# Altium schematic sheet FMC_Carrier_channel.SchDoc
size A3
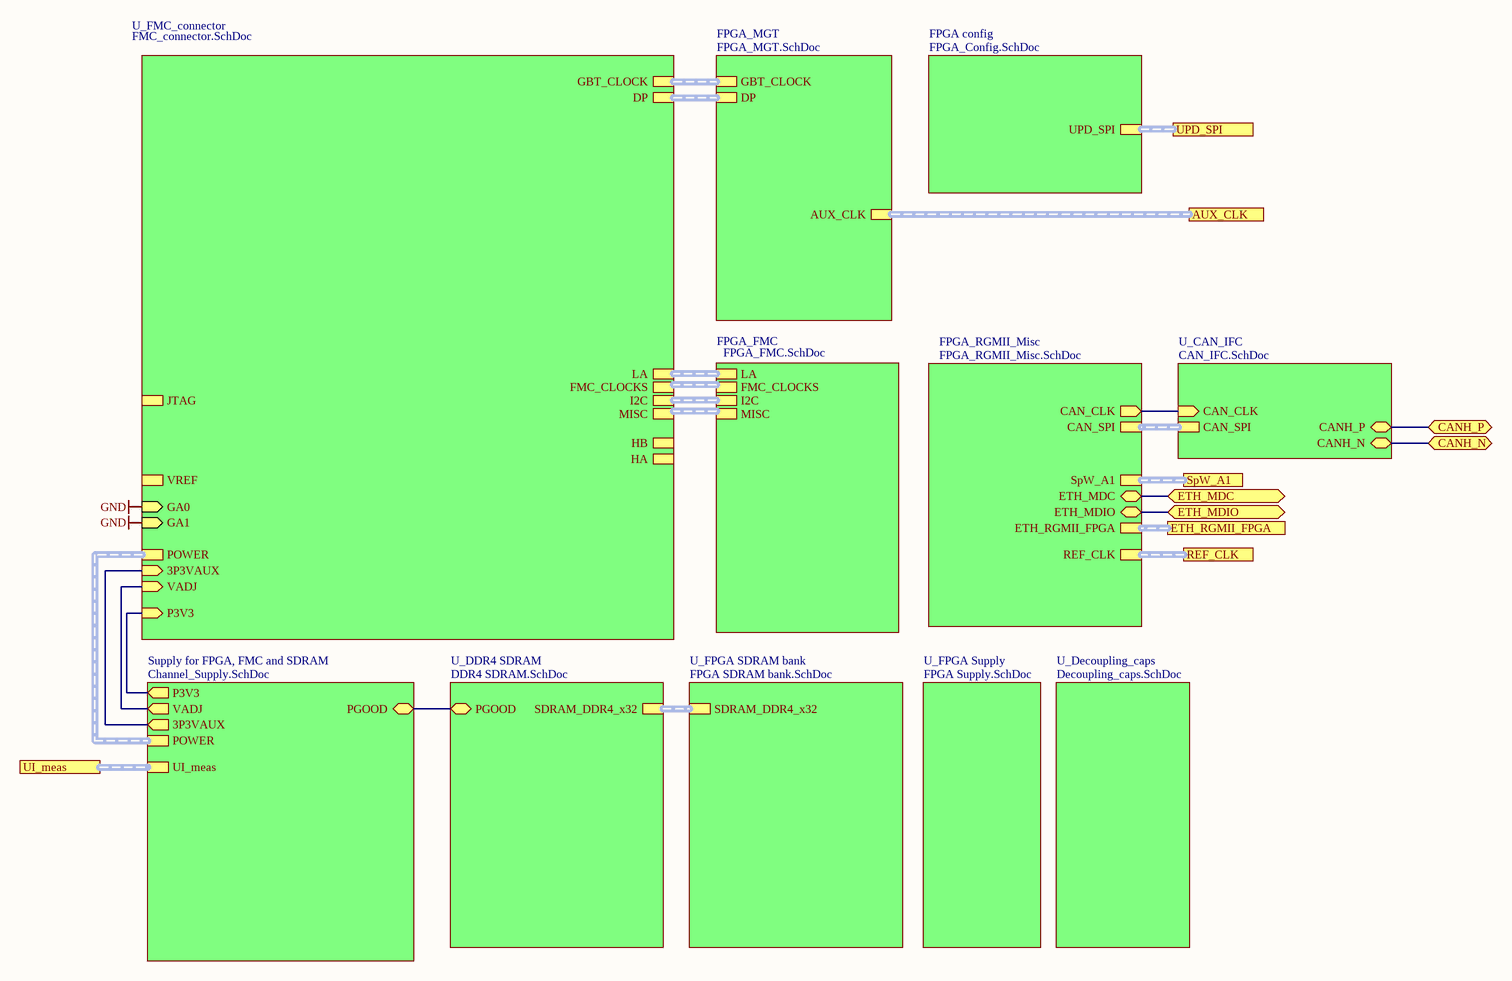
[diagram p0: FMC_Carrier_channel.SchDoc]

## Sub-sheets
FPGA config = FPGA_Config.SchDoc: UPD_SPI (harness UPD_SPI)
FPGA_FMC = FPGA_FMC.SchDoc: LA (harness FMC_J1_LA), FMC_CLOCKS (harness FMC_CLOCKS), I2C (harness I2C), MISC (harness MISC)
FPGA_MGT = FPGA_MGT.SchDoc: GBT_CLOCK, DP, AUX_CLK (harness CLK)
FPGA_RGMII_Misc = FPGA_RGMII_Misc.SchDoc: CAN_CLK (out), CAN_SPI, SpW_A1 (harness SpW), ETH_MDC (bidir), ETH_MDIO (bidir), ETH_RGMII_FPGA (harness RGMII), REF_CLK (harness CLK)
Supply for FPGA, FMC and SDRAM = Channel_Supply.SchDoc: P3V3 (out), VADJ (out), 3P3VAUX (out), POWER, PGOOD (bidir), UI_meas (harness Harness)
U_CAN_IFC = CAN_IFC.SchDoc: CANH_P (bidir), CANH_N (bidir), CAN_CLK (in), CAN_SPI (harness CAN_SPI)
U_DDR4 SDRAM = DDR4 SDRAM.SchDoc: PGOOD (bidir), SDRAM_DDR4_x32 (harness DDR4_x32)
U_Decoupling_caps = Decoupling_caps.SchDoc: no entries
U_FMC_connector = FMC_connector.SchDoc: DP (harness FMC_J1_DP), LA (harness FMC_J1_LA), HA (harness FMC_J1_HA), HB (harness FMC_J1_HB), MISC (harness MISC), POWER (harness FMC_J1_POWER), JTAG (harness FMC_J1_JTAG), I2C (harness I2C), FMC_CLOCKS (harness FMC_CLOCKS), VREF (harness FMC_J1_VREF), GA0 (in), GA1 (in), 3P3VAUX (in), GBT_CLOCK (harness GBT_CLOCK), VADJ (in), P3V3 (in)
U_FPGA SDRAM bank = FPGA SDRAM bank.SchDoc: SDRAM_DDR4_x32 (harness DDR4_x32)
U_FPGA Supply = FPGA Supply.SchDoc: no entries

## Ports
AUX_CLK (harness CLK), CANH_N (bidir), CANH_P (bidir), ETH_MDC (bidir), ETH_MDIO (bidir), ETH_RGMII_FPGA (harness RGMII), REF_CLK (harness CLK), SpW_A1 (harness SpW), UI_meas, UPD_SPI

## Nets
GND: sheet U_FMC_connector/GA0, sheet U_FMC_connector/GA1
CANH_N: port CANH_N, sheet U_CAN_IFC/CANH_N
CANH_P: port CANH_P, sheet U_CAN_IFC/CANH_P
ETH_MDC: port ETH_MDC, sheet FPGA_RGMII_Misc/ETH_MDC
ETH_MDIO: port ETH_MDIO, sheet FPGA_RGMII_Misc/ETH_MDIO
(unnamed): sheet U_FMC_connector/3P3VAUX, sheet Supply for FPGA, FMC and SDRAM/3P3VAUX
(unnamed): sheet U_FMC_connector/VADJ, sheet Supply for FPGA, FMC and SDRAM/VADJ
(unnamed): sheet U_FMC_connector/P3V3, sheet Supply for FPGA, FMC and SDRAM/P3V3
(unnamed): sheet FPGA_RGMII_Misc/CAN_CLK, sheet U_CAN_IFC/CAN_CLK
(unnamed): sheet Supply for FPGA, FMC and SDRAM/PGOOD, sheet U_DDR4 SDRAM/PGOOD

## Buses and harness runs
harness port AUX_CLK = sheet FPGA_MGT/AUX_CLK
harness port ETH_RGMII_FPGA = sheet FPGA_RGMII_Misc/ETH_RGMII_FPGA
harness port REF_CLK = sheet FPGA_RGMII_Misc/REF_CLK
harness port SpW_A1 = sheet FPGA_RGMII_Misc/SpW_A1
harness port UI_meas = sheet Supply for FPGA, FMC and SDRAM/UI_meas
harness port UPD_SPI = sheet FPGA config/UPD_SPI
harness sheet FPGA_FMC/I2C = sheet U_FMC_connector/I2C
harness sheet FPGA_FMC/LA = sheet U_FMC_connector/LA
harness sheet FPGA_MGT/DP = sheet U_FMC_connector/DP
harness sheet FPGA_MGT/GBT_CLOCK = sheet U_FMC_connector/GBT_CLOCK
harness sheet FPGA_RGMII_Misc/CAN_SPI = sheet U_CAN_IFC/CAN_SPI
harness sheet Supply for FPGA, FMC and SDRAM/POWER = sheet U_FMC_connector/POWER
harness sheet U_DDR4 SDRAM/SDRAM_DDR4_x32 = sheet U_FPGA SDRAM bank/SDRAM_DDR4_x32